# EAGLE design mainBoardV2 (EAGLE 6.6.0)

## Sheet 1 of 4
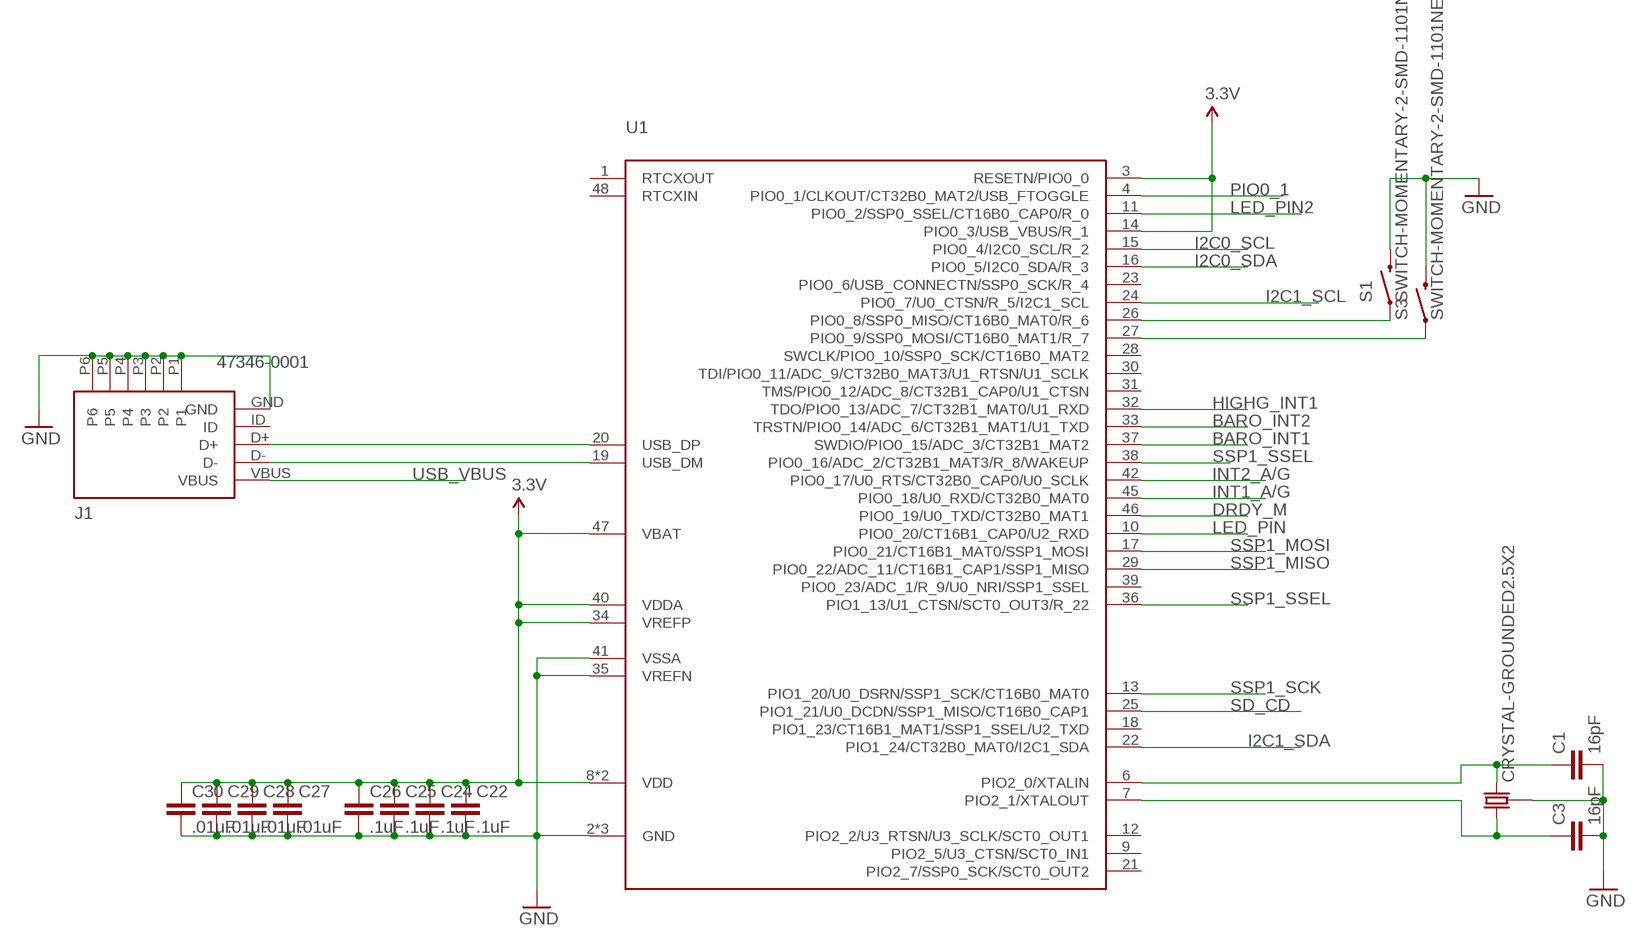
[diagram p0: schematic, sheet 1]

### Parts
C1  16pF  C0402  [C0402]
C3  16pF  C0402  [C0402]
C22  .1uF  C0402  [C0402]
C24  .1uF  C0402  [C0402]
C25  .1uF  C0402  [C0402]
C26  .1uF  C0402  [C0402]
C27  .01uF  C0402  [C0402]
C28  .01uF  C0402  [C0402]
C29  .01uF  C0402  [C0402]
C30  .01uF  C0402  [C0402]
J1  47346-0001  MICRO-USB  [MICRO_USB]
S1  SWITCH-MOMENTARY-2-SMD-1101NE  [TACTILE-SWITCH-1101NE]
S3  SWITCH-MOMENTARY-2-SMD-1101NE  [TACTILE-SWITCH-1101NE]
U1  LPC11U68JBD48  [LQFP48]
U$5  CRYSTAL-GROUNDED2.5X2  [CRYSTAL-SMD-2.5X2]

### Nets
3.3V: C22.1 C24.1 C25.1 C26.1 C27.1 C28.1 C29.1 C30.1 U1.3(RESETN/PIO0_0) U1.8(VDD) U1.14(PIO0_3/USB_VBUS/R_1) U1.34(VREFP) U1.40(VDDA) U1.44(VDD) U1.47(VBAT) ; also sheet 2,3,4
BARO_INT1: U1.37(SWDIO/PIO0_15/ADC_3/CT32B1_MAT2) ; also sheet 2
BARO_INT2: U1.33(TRSTN/PIO0_14/ADC_6/CT32B1_MAT1/U1_TXD) ; also sheet 2
DRDY_M: U1.46(PIO0_19/U0_TXD/CT32B0_MAT1) ; also sheet 2
GND: C1.2 C3.2 C22.2 C24.2 C25.2 C26.2 C27.2 C28.2 C29.2 C30.2 J1.GND J1.P1 J1.P2 J1.P3 J1.P4 J1.P5 J1.P6 S1.2 S3.2 U1.2(GND) U1.5(GND) U1.35(VREFN) U1.41(VSSA) U1.43(GND) U$5.GND1 U$5.GND2 ; also sheet 2,3,4
HIGHG_INT1: U1.32(TDO/PIO0_13/ADC_7/CT32B1_MAT0/U1_RXD) ; also sheet 2
HIGHG_INT2: U1.36(PIO1_13/U1_CTSN/SCT0_OUT3/R_22) ; also sheet 2
I2C0_SCL: U1.15(PIO0_4/I2C0_SCL/R_2) ; also sheet 2
I2C0_SDA: U1.16(PIO0_5/I2C0_SDA/R_3) ; also sheet 2
I2C1_SCL: U1.24(PIO0_7/U0_CTSN/R_5/I2C1_SCL) ; also sheet 2,3
I2C1_SDA: U1.22(PIO1_24/CT32B0_MAT0/I2C1_SDA) ; also sheet 2,3
INT1_A/G: U1.45(PIO0_18/U0_RXD/CT32B0_MAT0) ; also sheet 2
INT2_A/G: U1.42(PIO0_17/U0_RTS/CT32B0_CAP0/U0_SCLK) ; also sheet 2
LED_PIN: U1.10(PIO0_20/CT16B1_CAP0/U2_RXD) ; also sheet 3
LED_PIN2: U1.11(PIO0_2/SSP0_SSEL/CT16B0_CAP0/R_0) ; also sheet 3
N$2: C3.1 U1.7(PIO2_1/XTALOUT) U$5.P1
N$3: C1.1 U1.6(PIO2_0/XTALIN) U$5.P2
N$15: J1.D+ U1.20(USB_DP)
N$17: J1.D- U1.19(USB_DM)
N$18: S3.1 U1.27(PIO0_9/SSP0_MOSI/CT16B0_MAT1/R_7)
N$19: S1.1 U1.26(PIO0_8/SSP0_MISO/CT16B0_MAT0/R_6)
PIO0_1: U1.4(PIO0_1/CLKOUT/CT32B0_MAT2/USB_FTOGGLE) ; also sheet 4
SD_CD: U1.25(PIO1_21/U0_DCDN/SSP1_MISO/CT16B0_CAP1) ; also sheet 3
SSP1_MISO: U1.29(PIO0_22/ADC_11/CT16B1_CAP1/SSP1_MISO) ; also sheet 3
SSP1_MOSI: U1.17(PIO0_21/CT16B1_MAT0/SSP1_MOSI) ; also sheet 3
SSP1_SCK: U1.13(PIO1_20/U0_DSRN/SSP1_SCK/CT16B0_MAT0) ; also sheet 3
SSP1_SSEL: U1.38(PIO0_16/ADC_2/CT32B1_MAT3/R_8/WAKEUP) ; also sheet 3
USB_VBUS: J1.VBUS ; also sheet 4
Unconnected: J1.ID U1.1(RTCXOUT) U1.9(PIO2_5/U3_CTSN/SCT0_IN1) U1.12(PIO2_2/U3_RTSN/U3_SCLK/SCT0_OUT1) U1.18(PIO1_23/CT16B1_MAT1/SSP1_SSEL/U2_TXD) U1.21(PIO2_7/SSP0_SCK/SCT0_OUT2) U1.23(PIO0_6/USB_CONNECTN/SSP0_SCK/R_4) U1.28(SWCLK/PIO0_10/SSP0_SCK/CT16B0_MAT2) U1.30(TDI/PIO0_11/ADC_9/CT32B0_MAT3/U1_RTSN/U1_SCLK) U1.31(TMS/PIO0_12/ADC_8/CT32B1_CAP0/U1_CTSN) U1.39(PIO0_23/ADC_1/R_9/U0_NRI/SSP1_SSEL) U1.48(RTCXIN)

## Sheet 2 of 4
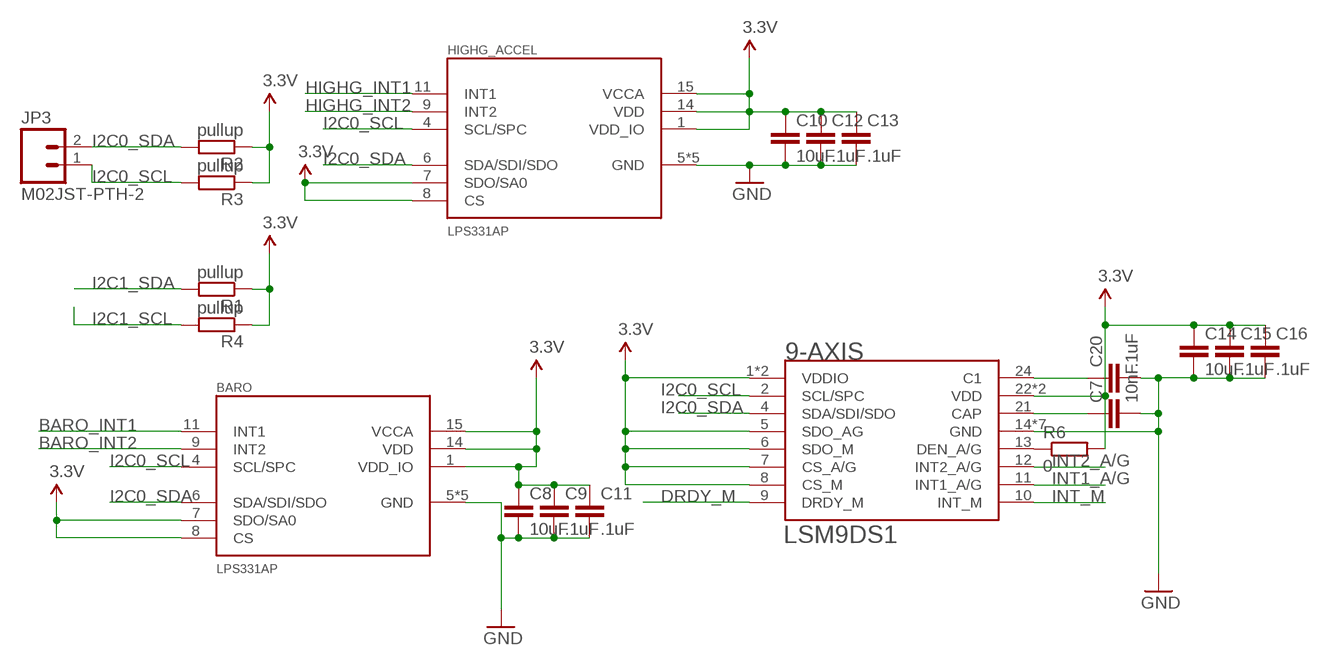
[diagram p1: schematic, sheet 2]

### Parts
9-AXIS  LSM9DS1  [LGA-24L-3.5X3X1]
BARO  LPS331AP  [LGA-16-3X3X1]
C7  10nF  C0402  [C0402]
C8  10uF  C0402  [C0402]
C9  .1uF  C0402  [C0402]
C10  10uF  C0402  [C0402]
C11  .1uF  C0402  [C0402]
C12  .1uF  C0402  [C0402]
C13  .1uF  C0402  [C0402]
C14  10uF  C0402  [C0402]
C15  .1uF  C0402  [C0402]
C16  .1uF  C0402  [C0402]
C20  .1uF  C0402  [C0402]
HIGHG_ACCEL  LPS331AP  [LGA-16-3X3X1]
JP3  M02JST-PTH-2  [JST-2-PTH]
R1  pullup  R0805  [R0805]
R2  pullup  R0402  [R0402]
R3  pullup  R0402  [R0402]
R4  pullup  R0805  [R0805]
R6  0  R0402  [R0402]

### Nets
3.3V: 9-AXIS.1(VDDIO) 9-AXIS.3(VDDIO) 9-AXIS.5(SDO_AG) 9-AXIS.6(SDO_M) 9-AXIS.7(CS_A/G) 9-AXIS.8(CS_M) 9-AXIS.22(VDD) 9-AXIS.23(VDD) BARO.1(VDD_IO) BARO.7(SDO/SA0) BARO.8(CS) BARO.14(VDD) BARO.15(VCCA) C8.1 C9.1 C10.1 C11.1 C12.1 C13.1 C14.1 C15.1 C16.1 HIGHG_ACCEL.1(VDD_IO) HIGHG_ACCEL.7(SDO/SA0) HIGHG_ACCEL.8(CS) HIGHG_ACCEL.14(VDD) HIGHG_ACCEL.15(VCCA) R1.1 R2.1 R3.1 R4.1 R6.2 ; also sheet 1,3,4
BARO_INT1: BARO.11(INT1) ; also sheet 1
BARO_INT2: BARO.9(INT2) ; also sheet 1
DRDY_M: 9-AXIS.9(DRDY_M) ; also sheet 1
GND: 9-AXIS.14(GND) 9-AXIS.15(GND) 9-AXIS.16(GND) 9-AXIS.17(GND) 9-AXIS.18(GND) 9-AXIS.19(GND) 9-AXIS.20(GND) BARO.5(GND) BARO.10(GND) BARO.12(GND) BARO.13(GND) BARO.16(GND) C7.2 C8.2 C9.2 C10.2 C11.2 C12.2 C13.2 C14.2 C15.2 C16.2 C20.2 HIGHG_ACCEL.5(GND) HIGHG_ACCEL.10(GND) HIGHG_ACCEL.12(GND) HIGHG_ACCEL.13(GND) HIGHG_ACCEL.16(GND) ; also sheet 1,3,4
HIGHG_INT1: HIGHG_ACCEL.11(INT1) ; also sheet 1
HIGHG_INT2: HIGHG_ACCEL.9(INT2) ; also sheet 1
I2C0_SCL: 9-AXIS.2(SCL/SPC) BARO.4(SCL/SPC) HIGHG_ACCEL.4(SCL/SPC) JP3.1 R3.2 ; also sheet 1
I2C0_SDA: 9-AXIS.4(SDA/SDI/SDO) BARO.6(SDA/SDI/SDO) HIGHG_ACCEL.6(SDA/SDI/SDO) JP3.2 R2.2 ; also sheet 1
I2C1_SCL: R4.2 ; also sheet 1,3
I2C1_SDA: R1.2 ; also sheet 1,3
INT1_A/G: 9-AXIS.11(INT1_A/G) ; also sheet 1
INT2_A/G: 9-AXIS.12(INT2_A/G) ; also sheet 1
INT_M: 9-AXIS.10(INT_M)
N$1: 9-AXIS.13(DEN_A/G) R6.1
N$11: 9-AXIS.21(CAP) C7.1
N$14: 9-AXIS.24(C1) C20.1

## Sheet 3 of 4
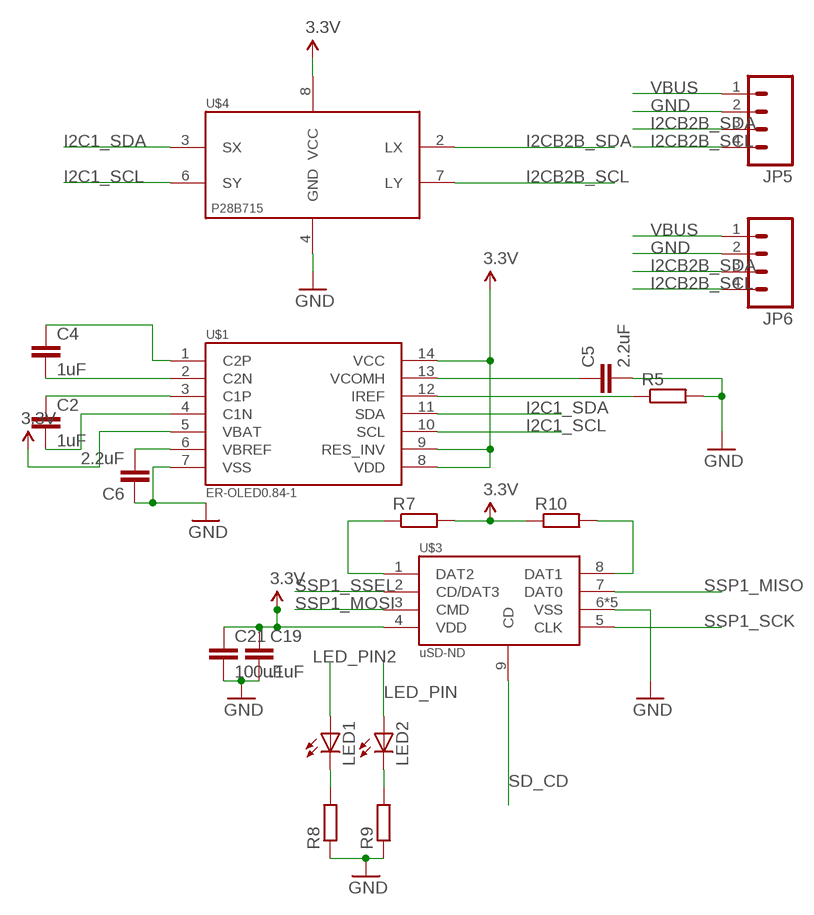
[diagram p2: schematic, sheet 3]

### Parts
C2  1uF  C0402  [C0402]
C4  1uF  C0402  [C0402]
C5  2.2uF  C0402  [C0402]
C6  2.2uF  C0402  [C0402]
C19  .1uF  C0402  [C0402]
C21  100uF  CC1206  [C1206]
JP5  M04JST  [1X04-1.5MM_JST]
JP6  M04JST  [1X04-1.5MM_JST]
LED1  LEDCHIPLED_0603  [CHIPLED_0603]
LED2  LEDCHIPLED_0603  [CHIPLED_0603]
R5  R0402  [R0402]
R7  R0402  [R0402]
R8  R0402  [R0402]
R9  R0402  [R0402]
R10  R0402  [R0402]
U$1  ER-OLED0.84-1  [MOLEX_52892-1433]
U$3  MICROSD-CD  [MOLEX_SD-47352-101]
U$4  P82B715  [SO8]

### Nets
3.3V: C19.1 C21.1 R7.2 R10.1 U$1.5(VBAT) U$1.8(VDD) U$1.9(RES_INV) U$1.14(VCC) U$3.4(VDD) U$4.8(VCC) ; also sheet 1,2,4
GND: C5.2 C6.1 C19.2 C21.2 JP5.2 JP6.2 R5.2 R8.1 R9.1 U$1.7(VSS) U$3.6(VSS) U$3.G1(VSS) U$3.G2(VSS) U$3.G3(VSS) U$3.G4(VSS) U$4.4(GND) ; also sheet 1,2,4
I2C1_SCL: U$1.10(SCL) U$4.6(SY) ; also sheet 1,2
I2C1_SDA: U$1.11(SDA) U$4.3(SX) ; also sheet 1,2
I2CB2B_SCL: JP5.4 JP6.4 U$4.7(LY)
I2CB2B_SDA: JP5.3 JP6.3 U$4.2(LX)
LED_PIN: LED2.A ; also sheet 1
LED_PIN2: LED1.A ; also sheet 1
N$4: LED1.C R8.2
N$5: LED2.C R9.2
N$6: C4.1 U$1.1(C2P)
N$7: C4.2 U$1.2(C2N)
N$8: C2.1 U$1.3(C1P)
N$9: C2.2 U$1.4(C1N)
N$10: C5.1 U$1.13(VCOMH)
N$12: R5.1 U$1.12(IREF)
N$13: C6.2 U$1.6(VBREF)
N$16: R7.1 U$3.1(DAT2)
N$21: R10.2 U$3.8(DAT1)
SD_CD: U$3.9(CD) ; also sheet 1
SSP1_MISO: U$3.7(DAT0) ; also sheet 1
SSP1_MOSI: U$3.3(CMD) ; also sheet 1
SSP1_SCK: U$3.5(CLK) ; also sheet 1
SSP1_SSEL: U$3.2(CD/DAT3) ; also sheet 1
VBUS: JP5.1 JP6.1 ; also sheet 4

## Sheet 4 of 4: Power
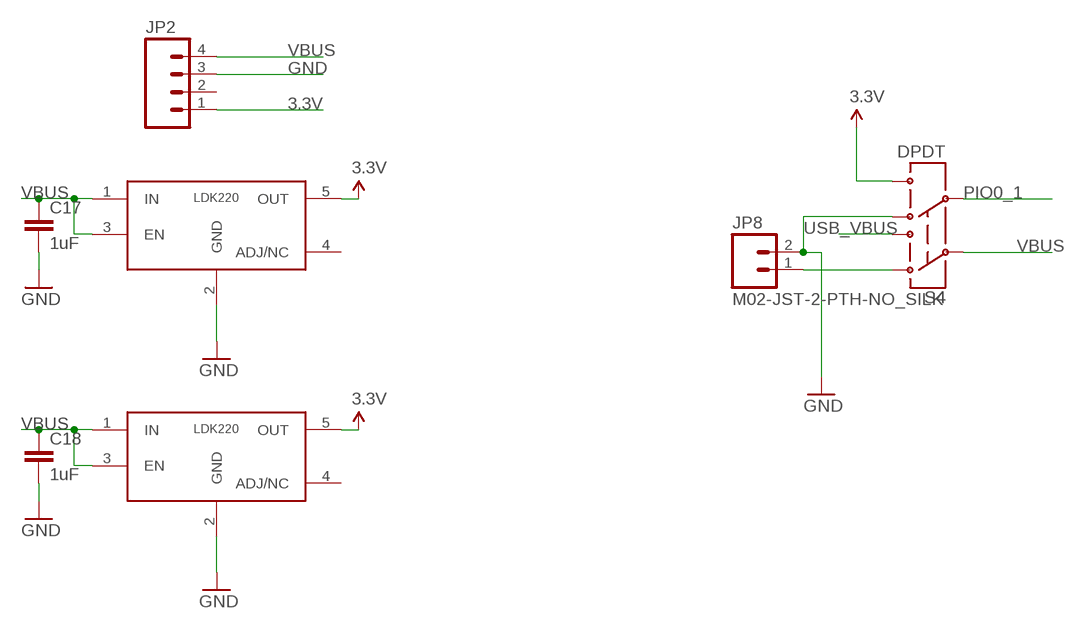
[diagram p3: schematic, sheet 4]

### Parts
C17  1uF  C0402  [C0402]
C18  1uF  C0402  [C0402]
JP2  M04JST  [1X04-1.5MM_JST]
JP8  M02-JST-2-PTH-NO_SILK  [JST-2-PTH-NS]
S4  DPDT  SWITCH-DPDTAYZ0202  [AYZ0202]
U$2  LDK220M33R  [SOT23-5]
U$6  LDK220M33R  [SOT23-5]

### Nets
3.3V: JP2.1 S4.6 U$2.5(OUT) U$6.5(OUT) ; also sheet 1,2,3
GND: C17.2 C18.2 JP2.3 JP8.2 S4.4 U$2.2(GND) U$6.2(GND) ; also sheet 1,2,3
N$20: JP8.1 S4.1
PIO0_1: S4.5 ; also sheet 1
USB_VBUS: S4.3 ; also sheet 1
VBUS: C17.1 C18.1 JP2.4 S4.2 U$2.1(IN) U$2.3(EN) U$6.1(IN) U$6.3(EN) ; also sheet 3
Unconnected: JP2.2 U$2.4(ADJ/NC) U$6.4(ADJ/NC)

## Library data of the parts
9-AXIS = Sensors:LSM9DS1; OC_NEWARK: unknown
BARO HIGHG_ACCEL = Sensors:LPS331AP; MPN: LPS331APTR; OC_NEWARK: 52X6707
C1 C3 = ELL-i-Passives:C: Surface Mount Capasitors — in standard sizes A capacitor used to store energy electrostatically in an electric field. If you need a high-value capacitor, consider using a polarised capacitor to save space. Wikipedia article on capacitors <https://en.wikipedia.org/wiki/Capacitor>; OC_NEWARK: unknown
C2 C4 = ELL-i-Passives:C: Surface Mount Capasitors — in standard sizes A capacitor used to store energy electrostatically in an electric field. If you need a high-value capacitor, consider using a polarised capacitor to save space. Wikipedia article on capacitors <https://en.wikipedia.org/wiki/Capacitor>; MPN: MC0402X105M6R3CT; OC_NEWARK: 06R4879
C5 C6 = ELL-i-Passives:C: Surface Mount Capasitors — in standard sizes A capacitor used to store energy electrostatically in an electric field. If you need a high-value capacitor, consider using a polarised capacitor to save space. Wikipedia article on capacitors <https://en.wikipedia.org/wiki/Capacitor>; MPN: C1005X6S0G225M050BC; OC_NEWARK: 91R0047
C7 C20 = ELL-i-Passives:C: Surface Mount Capasitors — in standard sizes A capacitor used to store energy electrostatically in an electric field. If you need a high-value capacitor, consider using a polarised capacitor to save space. Wikipedia article on capacitors <https://en.wikipedia.org/wiki/Capacitor>; MPN: S103M47Z5UN63L0R; OC_NEWARK: 83K9283
C8-C19 C21 C22 C24-C30 = ELL-i-Passives:C: Surface Mount Capasitors — in standard sizes A capacitor used to store energy electrostatically in an electric field. If you need a high-value capacitor, consider using a polarised capacitor to save space. Wikipedia article on capacitors <https://en.wikipedia.org/wiki/Capacitor>
J1 = ELL-i-Connectors:MICRO-USB: Micro USB from Molex CONN RCPT 5POS MICRO USB R/A Datasheet <http://www.molex.com/pdm_docs/sd/473460001_sd.pdf>; PARTNO: AS-ITM-00021
JP2 = SparkFun-Connectors:M04: Header 4 Standard 4-pin 0.1" header. Use with straight break away headers (SKU : PRT-00116), right angle break away headers (PRT-00553), swiss pins (PRT-00743), machine pins (PRT-00117), and female headers (PRT-00115). Molex polarized connector foot print use with SKU : PRT-08231 with associated crimp pins and housings. 1MM SMD Version SKU: PRT-10208
JP3 = SparkFun-Connectors:M02: Standard 2-pin 0.1" header. Use with - straight break away headers ( PRT-00116) - right angle break away headers (PRT-00553) - swiss pins (PRT-00743) - machine pins (PRT-00117) - female headers (PRT-00115) Molex polarized connector foot print use with: PRT-08233 with associated crimp pins and housings. 2.54_SCREWTERM for use with PRT-10571. 3.5mm Screw Terminal footprints for PRT-08084 5mm Screw Terminal footprints for use with PRT-08432; OC_NEWARK: unknown; SKU: PRT-09914
JP5 JP6 = SparkFun-Connectors:M04: Header 4 Standard 4-pin 0.1" header. Use with straight break away headers (SKU : PRT-00116), right angle break away headers (PRT-00553), swiss pins (PRT-00743), machine pins (PRT-00117), and female headers (PRT-00115). Molex polarized connector foot print use with SKU : PRT-08231 with associated crimp pins and housings. 1MM SMD Version SKU: PRT-10208; OC_NEWARK: unknown
JP8 = SparkFun-Connectors:M02: Standard 2-pin 0.1" header. Use with - straight break away headers ( PRT-00116) - right angle break away headers (PRT-00553) - swiss pins (PRT-00743) - machine pins (PRT-00117) - female headers (PRT-00115) Molex polarized connector foot print use with: PRT-08233 with associated crimp pins and housings. 2.54_SCREWTERM for use with PRT-10571. 3.5mm Screw Terminal footprints for PRT-08084 5mm Screw Terminal footprints for use with PRT-08432; OC_NEWARK: unknown
LED1 LED2 = adafruit:LED: LED OSRAM: - CHIPLED LG R971, LG N971, LY N971, LG Q971, LY Q971, LO R971, LY R971 LH N974, LH R974 LS Q976, LO Q976, LY Q976 LO Q996 - Hyper CHIPLED LW Q18S LB Q993, LB Q99A, LB R99A - SideLED LS A670, LO A670, LY A670, LG A670, LP A670 LB A673, LV A673, LT A673, LW A673 LH A674 LY A675 LS A676, LA A676, LO A676, LY A676, LW A676 LS A679, LY A679, LG A679 - Hyper Micro SIDELED® LS Y876, LA Y876, LO Y876, LY Y876 LT Y87S - SmartLED LW L88C, LW L88S LB L89C, LB L89S, LG L890 LS L89K, LO L89K, LY L89K LS L896, LA L896, LO L896, LY L896 - TOPLED LS T670, LO T670, LY T670, LG T670, LP T670 LSG T670, LSP T670, LSY T670, LOP T670, LYG T670 LG T671, LOG T671, LSG T671 LB T673, LV T673, LT T673, LW T673 LH T674 LS T676, LA T676, LO T676, LY T676, LB T676, LH T676, LSB T676, LW T676 LB T67C, LV T67C, LT T67C, LS T67K, LO T67K, LY T67K, LW E67C LS E67B, LA E67B, LO E67B, LY E67B, LB E67C, LV E67C, LT E67C LW T67C LS T679, LY T679, LG T679 LS T770, LO T770, LY T770, LG T770, LP T770 LB T773, LV T773, LT T773, LW T773 LH T774 LS E675, LA E675, LY E675, LS T675 LS T776, LA T776, LO T776, LY T776, LB T776 LHGB T686 LT T68C, LB T68C - Hyper Mini TOPLED® LB M676 - Mini TOPLED Santana® LG M470 LS M47K, LO M47K, LY M47K Source: http://www.osram.convergy.de/; OC_NEWARK: unknown
R1-R5 R8 R9 = ELL-i-Passives:R: Surface Mount Resistor — in standard sizes; OC_NEWARK: unknown
R6 R7 R10 = ELL-i-Passives:R: Surface Mount Resistor — in standard sizes
S1 S3 = SparkFun-Electromechanical:SWITCH-MOMENTARY-2: Various NO switches- pushbuttons, reed, etc; OC_NEWARK: unknown
S4 = SparkFun-Electromechanical:SWITCH-DPDT: DPDT Version of the COM-00597; OC_NEWARK: unknown; PROD_ID: SWCH-08179
U1 = LPC11U68:LPC11U68JBD48; OC_NEWARK: unknown
U$1 = Sensors:ER-OLED0.84-1; OC_NEWARK: unknown
U$2 U$6 = Sensors:LDK220M33R; OC_NEWARK: unknown
U$3 = Sensors:MICROSD-CD; OC_NEWARK: unknown
U$4 = Sensors:P82B715; OC_NEWARK: unknown
U$5 = SparkFun-FreqCtrl:CRYSTAL-GROUNDED; OC_NEWARK: unknown

## Board
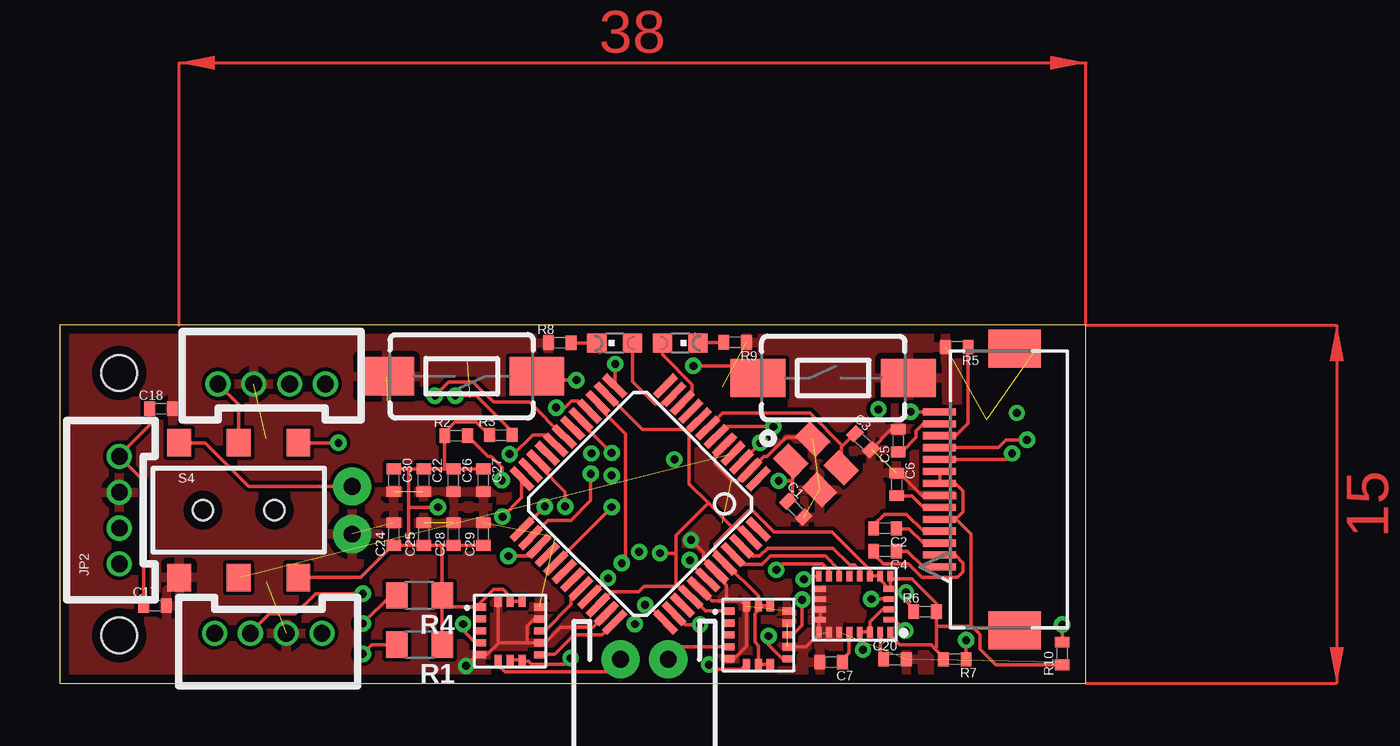
[diagram p4: board, top side]
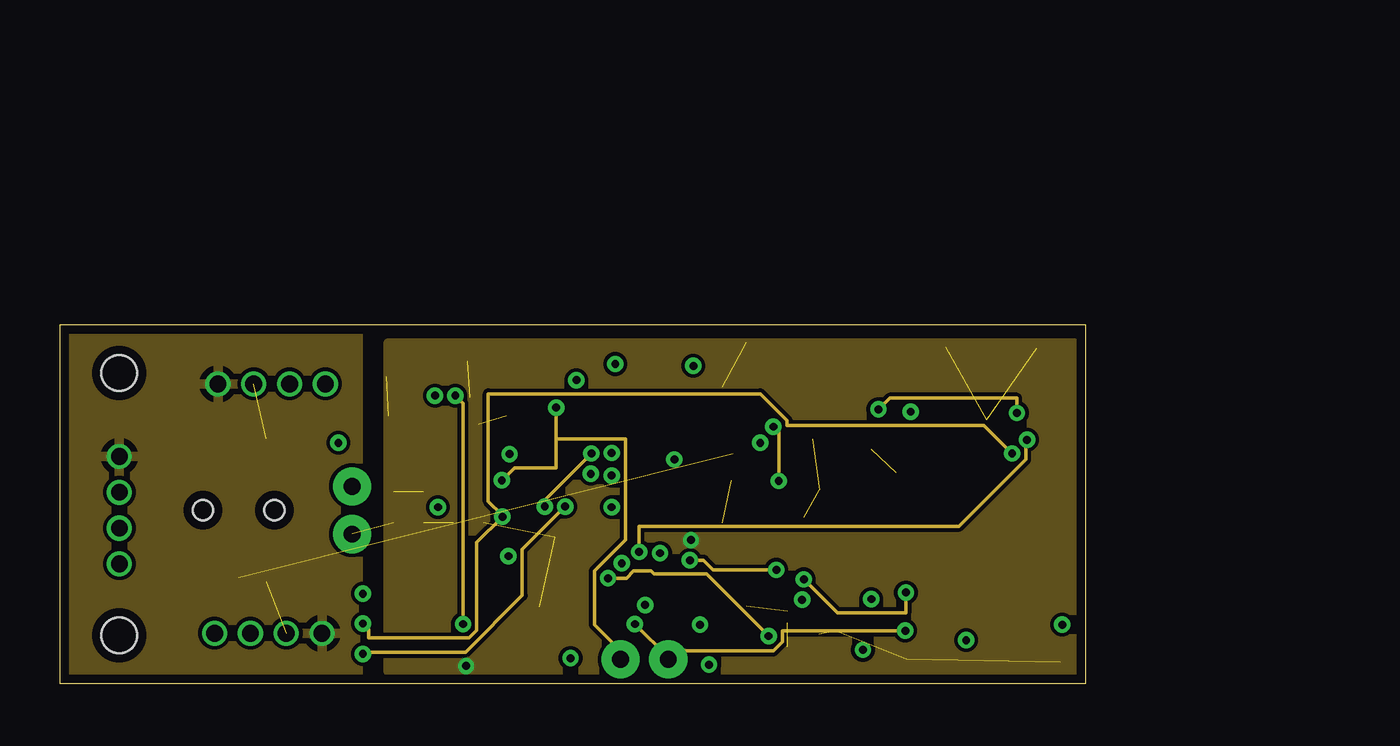
[diagram p5: board, inner layer Route2]
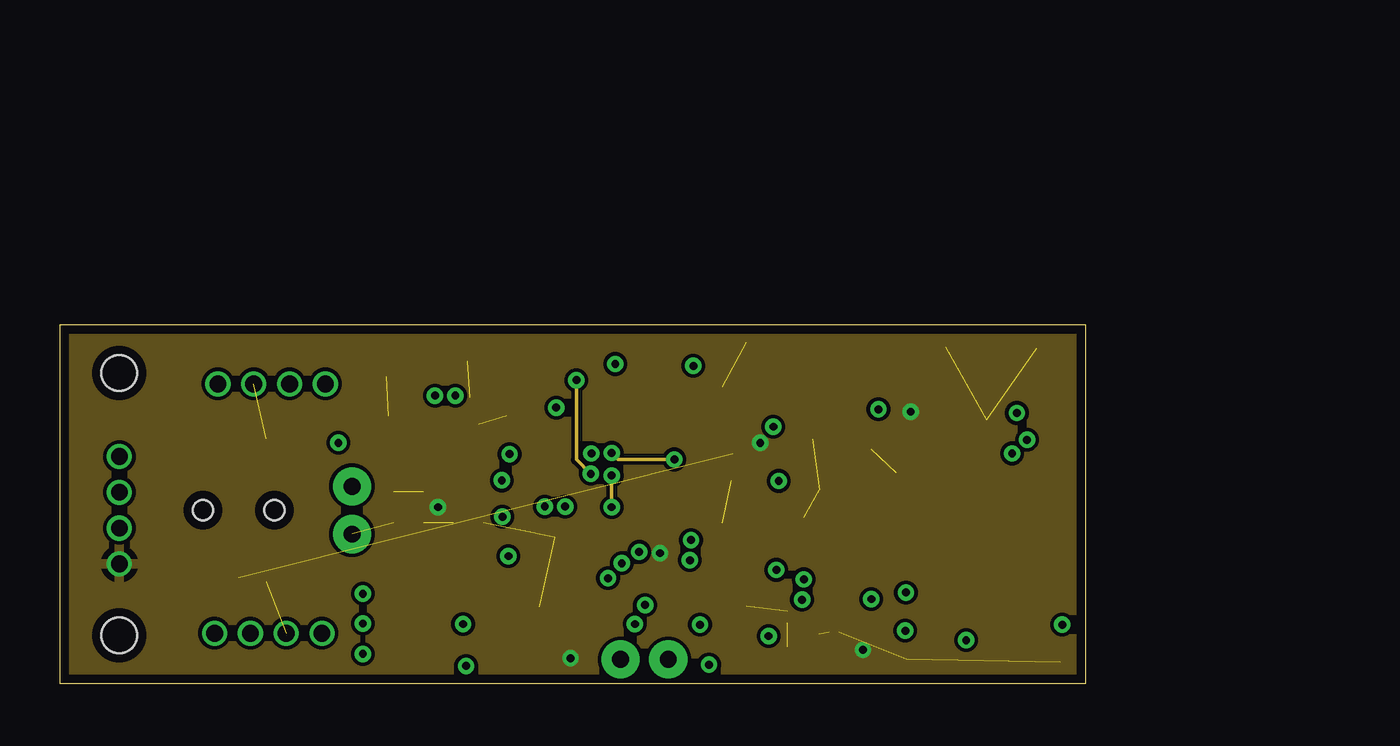
[diagram p6: board, inner layer Route15]
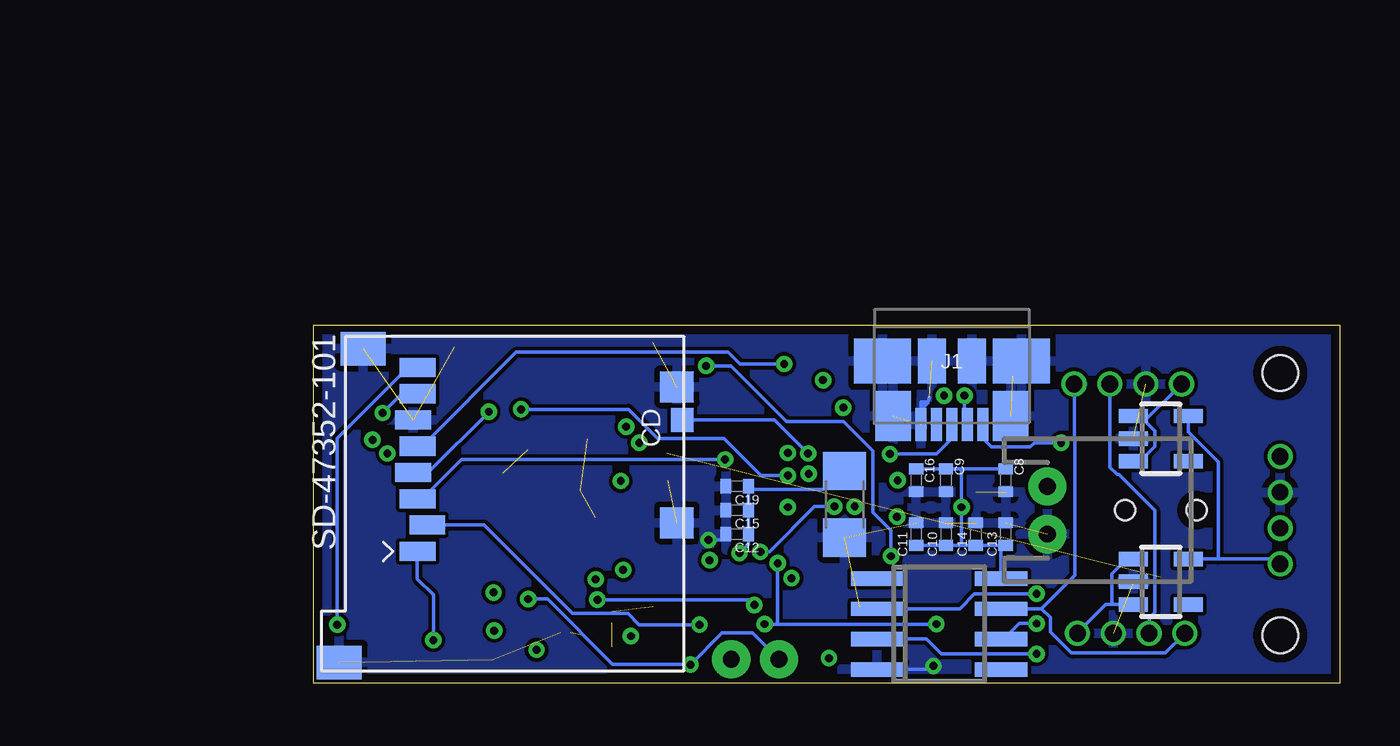
[diagram p7: board, bottom side, seen from below]

Size 43 x 15 mm. Coordinates in mm from the lower left corner, seen from the top.
Outline: 0,0 43,0 43,15 0,15 0,0
Copper layers (1*2*15*16): Top 0.0356mm / dielectric 1.5011mm / Route2 0.0356mm / dielectric 0.1499mm / Route15 0.0356mm / dielectric 0.2007mm / Bottom 0.0356mm
Design rules "LaenPCBOrder *": minimum track width 6mil, minimum drill 13mil, track to track 6mil, track to pad 6mil, pad to pad 6mil, via to via 6mil, smd to smd 6mil, copper to edge 15mil, drill to drill 6mil, minimum pad ring 7mil, minimum via ring 7mil, stop-mask expansion 3mil, vias tented up to drill 0mil, thermal gap 10mil
Holes 1.5 mm at 2.5,2 2.5,13

### Footprints (pad centres in the part's own frame; a part is rotated, then mirrored left to right if it is on the bottom)
LGA-24L-3.5X3X1 = smd 0.24 x 0.45: 1 0.245,2.675; 6 0.245,0.325; 7 0.675,0.325; 8 1.105,0.325; 9 1.535,0.325; 10 1.965,0.325; 11 2.395,0.325; 12 2.825,0.325; 13 3.255,0.325; 18 3.255,2.675; 19 2.825,2.675; 20 2.395,2.675; 21 1.965,2.675; 22 1.535,2.675; 23 1.105,2.675; 24 0.675,2.675 | smd 0.45 x 0.24: 2 0.325,2.145; 3 0.325,1.715; 4 0.325,1.285; 5 0.325,0.855; 14 3.175,0.855; 15 3.175,1.285; 16 3.175,1.715; 17 3.175,2.145
LGA-16-3X3X1 = smd 0.45 x 0.3: 1 0.275,2.5; 2 0.275,2; 3 0.275,1.5; 4 0.275,1; 5 0.275,0.5; 9 2.725,0.5; 10 2.725,1; 11 2.725,1.5; 12 2.725,2; 13 2.725,2.5 | smd 0.3 x 0.45: 6 1,0.275; 7 1.5,0.275; 8 2,0.275; 14 2,2.725; 15 1.5,2.725; 16 1,2.725
C0402 = smd 0.45 x 0.6: 1 -0.475,0; 2 0.475,0
C1206 = smd 1.6 x 1.8: 1 -1.4,0; 2 1.4,0
MICRO_USB = smd 1.38 x 0.45: D+ 2.66,0; D- 2.66,0.65; GND 2.66,-1.3; ID 2.66,-0.65; VBUS 2.66,1.3 | smd 2.1 x 1.475: P1 2.3,-2.462; P2 2.3,2.462 | smd 1.9 x 2.375: P3 0,2.913; P4 0,-2.913 | smd 1.9 x 1.175: P5 0,0.838; P6 0,-0.838
1X04-1.5MM_JST = drill 0.7: 1 0,0; 2 1.5,0; 3 3,0; 4 4.5,0
JST-2-PTH = drill 0.7 pad 1.6: 1 -1,0; 2 1,0
JST-2-PTH-NS = drill 0.7 pad 1.6: 1 -1,0; 2 1,0
CHIPLED_0603 = smd 0.8 x 0.8: A 0,-0.75; C 0,0.75
R0805 = smd 0.9 x 1.1: 1 -0.95,0; 2 0.95,0
R0402 = smd 0.45 x 0.6: 1 -0.475,0; 2 0.475,0
TACTILE-SWITCH-1101NE = smd 2.3 x 1.6: 1 -3.15,0; 2 3.15,0
AYZ0202 = smd 1 x 1.15: 1 -2.5,2.825; 2 0,2.825; 3 2.5,2.825; 4 -2.5,-2.825; 5 0,-2.825; 6 2.5,-2.825 | hole 0.85: 1.5,0; -1.5,0
LQFP48 = smd 0.3 x 1.2: 1 -2.75,-4.25; 2 -2.25,-4.25; 3 -1.75,-4.25; 4 -1.25,-4.25; 5 -0.75,-4.25; 6 -0.25,-4.25; 7 0.25,-4.25; 8 0.75,-4.25; 9 1.25,-4.25; 10 1.75,-4.25; 11 2.25,-4.25; 12 2.75,-4.25; 25 2.75,4.25; 26 2.25,4.25; 27 1.75,4.25; 28 1.25,4.25; 29 0.75,4.25; 30 0.25,4.25; 31 -0.25,4.25; 32 -0.75,4.25; 33 -1.25,4.25; 34 -1.75,4.25; 35 -2.25,4.25; 36 -2.75,4.25 | smd 1.2 x 0.3: 13 4.25,-2.75; 14 4.25,-2.25; 15 4.25,-1.75; 16 4.25,-1.25; 17 4.25,-0.75; 18 4.25,-0.25; 19 4.25,0.25; 20 4.25,0.75; 21 4.25,1.25; 22 4.25,1.75; 23 4.25,2.25; 24 4.25,2.75; 37 -4.25,2.75; 38 -4.25,2.25; 39 -4.25,1.75; 40 -4.25,1.25; 41 -4.25,0.75; 42 -4.25,0.25; 43 -4.25,-0.25; 44 -4.25,-0.75; 45 -4.25,-1.25; 46 -4.25,-1.75; 47 -4.25,-2.25; 48 -4.25,-2.75
MOLEX_52892-1433 = smd 0.3 x 1.4: 1 3.25,2.896; 2 2.75,2.896; 3 2.25,2.896; 4 1.75,2.896; 5 1.25,2.896; 6 0.75,2.896; 7 0.25,2.896; 8 -0.25,2.896; 9 -0.75,2.896; 10 -1.25,2.896; 11 -1.75,2.896; 12 -2.25,2.896; 13 -2.75,2.896; 14 -3.25,2.896 | smd 1.6 x 2.2: LFIT -5.9,6.046; RFIT 5.9,6.046
SOT23-5 = smd 0.6 x 1.2: 1 -0.95,-1.15; 2 0,-1.15; 3 0.95,-1.15; 4 0.95,1.15; 5 -0.95,1.15
MOLEX_SD-47352-101 = smd 0.8 x 1.5: 1 9.19,3.24; 2 8.09,3.64; 3 6.99,3.24; 4 5.89,3.04; 5 4.79,3.24; 6 3.69,3.04; 7 2.59,3.24; 8 1.49,3.24 | smd 1 x 0.95: 9 3.69,14.325 | smd 1.4 x 1.9: G1 13.85,-0.05; G4 0.7,0.95 | smd 1.3 x 1.4: G2 8,14.1; G3 2.3,14.1
SO8 = smd 0.6 x 2.2: 1 -1.905,-2.6; 2 -0.635,-2.6; 3 0.635,-2.6; 4 1.905,-2.6; 5 1.905,2.6; 6 0.635,2.6; 7 -0.635,2.6; 8 -1.905,2.6
CRYSTAL-SMD-2.5X2 = smd 1.2 x 0.9: GND1 0.6,1.8; GND2 2.3,0.5; P1 2.3,1.8; P2 0.6,0.5

### Placement (x,y rotation side)
9-AXIS  35.05,4.81 180 top
BARO  27.77,0.52 0 top
C1  30.84,7.29 315 top
C2  34.58,6.49 180 top
C3  33.65,10.12 315 top
C4  34.58,5.53 180 top
C5  35.13,10.17 90 top
C6  35.06,8.33 270 top
C7  32.32,0.88 180 top
C8  14,8.5 270 bottom
C9  16.5,8.5 270 bottom
C10  16.5,6.25 90 bottom
C11  17.75,6.25 90 bottom
C12  25.25,6.25 180 bottom
C13  14,6.25 90 bottom
C14  15.25,6.25 90 bottom
C15  25.25,7.25 180 bottom
C16  17.75,8.5 270 bottom
C17  4,3.25 0 top
C18  4.25,11.5 0 top
C19  25.25,8.25 180 bottom
C20  35,1 0 top
C21  20.75,7.5 270 bottom
C22  15.25,8.5 270 top
C24  14,6.25 90 top
C25  15.25,6.25 90 top
C26  16.5,8.5 270 top
C27  17.75,8.5 270 top
C28  16.5,6.25 90 top
C29  17.75,6.25 90 top
C30  14,8.5 270 top
HIGHG_ACCEL  17.37,0.69 0 top
J1  16.25,13.5 270 bottom
JP2  2.5,5 90 top
JP3  24.5,1 180 top
JP5  6.63,12.54 0 top
JP6  10.99,2.09 180 top
JP8  12.25,7.25 270 bottom
LED1  23.25,14.25 90 top
LED2  26,14.25 270 top
R1  15.08,1.62 180 top
R2  16.61,10.37 0 top
R3  18.48,10.4 0 top
R4  15.08,3.68 180 top
R5  37.58,14.09 180 top
R6  36.25,3 0 top
R7  37.5,1 180 top
R8  20.95,14.26 0 top
R9  28.3,14.28 180 top
R10  42,1.25 90 top
S1  16.84,12.86 180 top
S3  32.41,12.79 0 top
S4  7.5,7.25 0 top
U1  24.32,7.51 135 top
U$1  33.96,8.12 270 top
U$2  7.5,10.25 270 bottom
U$3  41.87,14.72 270 bottom
U$4  16.79,2.48 270 bottom
U$5  29.85,9.38 315 top
U$6  7.5,4.25 270 bottom

### Tracks (layer width: path | path; a pad name or v marks a point on that pad's centre or on a via)
3.3V  (via drill 0.33)
  Top 0.152: 37.55,6.88 36.88,6.88 U$1.5 | 37.55,6.88 37.85,7.17 37.85,8.05 37.52,8.38 36.88,8.38 U$1.8 36.88,8.45 36.88,8.85 U$1.9 | 36.67,1.45 37.02,1.1 R7.2 | 36.67,1.45 36.52,1.6 35.2,1.6 34.8,2 9-AXIS.1 | 36.73,2.38 36.73,1.5 36.67,1.45 | 36.73,2.38 R6.2 36.73,3.35 35.7,4.38 34.88,4.38 9-AXIS.6 34.8,4 9-AXIS.5 34.73,3.98 34.38,4.33 9-AXIS.7 34.3,4.5 33.95,4.5 9-AXIS.8 33.95,4.58 33.95,4.75 32.35,6.35 29.93,6.35 29.05,7.22 28.85,7.22 28.23,6.6 28.23,6.53 | R10.1 39.23,0.78 38.55,1.45 38.55,2.05 38.23,2.38 38.17,2.38 | 36.73,2.38 38.17,2.38 | 37.55,6.88 38.17,6.25 38.17,2.38 | BARO.1 28.02,3.02 27.05,3.02 U1.40 26.38,3.65 25.98,4.05 25.82,4.05 | 25.82,4.05 24.48,4.05 24.25,3.83 23.12,3.83 22.57,3.27 U1.34 | 26.38,10.62 24.43,10.62 22.95,12.1 22.93,12.1 U1.14 | 26.38,10.62 26.77,11.03 U1.8 | BARO.8 29.75,0.8 BARO.7 29.27,0.88 29.27,1.57 29.12,1.73 29.12,2.9 29.27,3.05 29.27,3.17 BARO.15 | BARO.15 29.75,3.25 BARO.14 | BARO.15 29.27,3.33 29.27,3.65 27.9,5.03 27.88,5.03 U1.44 27.8,5.08 27.45,5.42 27.45,5.83 28.15,6.53 | 28.15,6.53 28.23,6.53 | 28.23,6.53 28.45,6.53 28.88,6.1 28.9,6.1 U1.47 | 26.38,10.62 26.38,8.35 27.18,7.55 | 27.18,7.55 28.12,6.6 28.15,6.53 | 25.82,5.45 25.82,6.2 27.18,7.55 | 25.82,5.45 25.82,4.05 | HIGHG_ACCEL.14 19.35,3.42 HIGHG_ACCEL.15 18.88,3.5 18.88,3.62 18.57,3.92 18.18,3.92 17.52,3.27 HIGHG_ACCEL.1 17.62,3.2 16.43,3.2 16.02,3.6 R4.1 | R1.1 16.02,3.5 R4.1 | 14.62,8.97 C22.1 16.12,8.97 | 14.62,8.97 C30.1 | 16.12,8.97 C26.1 C27.1 | 16.12,8.97 16.12,10.35 R2.1 16.12,10.43 16.12,10.5 16.57,10.95 17.45,10.95 R3.1 | 14.62,5.78 C25.1 16.02,5.78 | 14.62,5.78 C24.1 13.93,5.75 12.6,4.42 S4.6
  Top 0.152: 16.02,5.78 C28.1 C29.1 | 14.62,5.78 14.62,7.38 | 14.62,7.38 14.62,8.97 | 16.02,5.78 16.02,3.75 R4.1 | 9-AXIS.3 34.48,3.1 33.95,2.58 33.95,2.23 9-AXIS.23 33.92,2.15 33.52,2.15 9-AXIS.22 33.52,2.08 33.52,1.52 v33.65,1.4 | HIGHG_ACCEL.7 18.88,0.97 19.35,0.97 HIGHG_ACCEL.8 19.43,0.93 19.65,0.93 19.77,0.8 21.15,0.8 v21.4,1.05 | v29.35,10.07 28.57,9.3 U1.3 | v35.65,11.38 U$1.14 | v15.85,7.38 14.62,7.38 | v25.15,5.45 25.82,5.45
  Bottom 0.152: 15.85,8.97 C26.1 C27.1 | 15.85,8.97 C30.1 | 15.85,5.78 C25.1 C24.1 14.2,5.7 14.2,4.4 U$4.8 | 15.85,5.78 C28.1 C29.1 | 15.85,5.78 v15.85,7.38 15.85,8.97 | C21.1 20.88,8.9 21.65,8.12 24.7,8.12 C19.1 C15.1 C12.1 24.77,5.83 v25.15,5.45 | 5.1,5.2 2.7,5.2 JP2.1 | 5.1,5.2 U$6.5 | U$2.5 6.35,10.53 5.1,9.28 5.1,5.2 | v35.65,11.38 38.2,8.82 U$3.4
  pour Route15: 0.5,14.5 42.5,14.5 42.5,0.25 0.5,0.25
BARO_INT1  (via drill 0.33)
  Top 0.152: v31.1,3.5 31.1,2.42 30.7,2.02 BARO.11 | v24.52,3.27 24.65,3.27 U1.37
  Bottom 0.152: v31.1,3.5 24.75,3.5 v24.52,3.27
BARO_INT2  (via drill 0.33)
  Top 0.152: v29.7,1.98 29.7,1.6 30.27,1.02 30.48,1.02 BARO.9 | v22.98,4.4 U1.33
  Route2 0.152: v29.7,1.98 27.1,4.58 24.9,4.58 24.77,4.7 24.05,4.7 23.75,4.4 v22.98,4.4
DRDY_M
  Top 0.152: 9-AXIS.9 33.52,4.5 33.52,4.72 33.3,4.95 33.1,4.95 32.4,5.65 29.65,5.65 29.32,5.33 29,5.33 28.57,5.75 U1.46
GND  (via drill 0.33)  (25 unrouted)
  Top 0.152: 18.4,1.7 17.9,1.2 HIGHG_ACCEL.5 17.57,1.2 17.5,1.2 v17.02,0.72 | 19.57,1.7 20.07,1.7 HIGHG_ACCEL.10 20.15,1.7 20.32,1.7 20.98,2.35 22.35,2.35 U1.35 | 19.57,1.7 18.4,1.7 | HIGHG_ACCEL.16 18.38,3.4 18.38,1.77 18.4,1.7 | BARO.5 28.25,1.02 28.77,1.55 28.77,3.23 BARO.16 28.7,3.27 28.52,3.45 27.93,3.45 | 27.93,3.45 27.32,3.45 26.82,3.95 26.8,3.95 U1.41 | 27.93,3.45 27.93,4.1 27.52,4.5 27.52,4.67 U1.43 27.45,4.72 26.98,5.2 26.98,5.47 v26.45,6 | U1.5 27.45,9.57 27.45,9.2 28.15,8.5 28.5,8.5 28.9,8.9 U1.2 28.98,8.97 29.5,9.5 29.62,9.5 30.43,10.3 31.45,10.3 31.52,10.22 U$5.GND1 | BARO.10 31.27,1.52 31.8,2.05 9-AXIS.18 31.8,2.2 31.8,2.65 9-AXIS.17 9-AXIS.16 | C3.2 34,9.8 34.85,10.65 C5.2 | U$1.7 36.12,7.88 35.2,8.8 35.08,8.8 C6.1 | 19.57,1.7 19.57,2.38 19.9,2.7 20.07,2.7 HIGHG_ACCEL.12 | C22.2
  Bottom 0.152: U$4.4 17.18,0.57 v17.02,0.72 | J1.GND 17.55,11.78 17.27,11.78 17.25,11.75 17.43,11.57 17.52,11.57 17.52,11.75 17.27,11.75 17.25,11.78 17.2,11.97 | v26.45,6 25.88,6 25.73,6.15 C12.2
  pour Bottom: 0.25,0 43,0 43,15 0.25,15
  pour Top: 0.25,15 43,15 43,0 0.25,0
  pour Route2: 13.75,14.25 42.5,14.25 42.5,0.5 13.75,0.5 13.75,14
HIGHG_INT1
  Top 0.152: HIGHG_ACCEL.11 20.32,2.2 21.43,3.3 21.43,3.55 21.82,3.95 U1.32
HIGHG_INT2
  Top 0.152: HIGHG_ACCEL.9 20.73,1.2 21.55,2.02 22.73,2.02 U1.36
I2C0_SCL  (via drill 0.33)
  Top 0.152: JP3.1 26.02,1.52 28.02,1.52 BARO.4 | v16.9,2.48 16.9,2.23 17.43,1.7 17.62,1.7 HIGHG_ACCEL.4 | v35.42,2.2 34.95,2.67 34.73,2.67 9-AXIS.2 | v16.57,12.05 17.45,12.05 18.95,10.55 R3.2 | v23.55,5.03 23.7,5.17 23.7,10.45 22.57,11.57 22.57,11.75 U1.15
  Route2 0.152: v24.1,2.48 25.5,1.07 JP3.1 25.5,1.35 29.9,1.35 30.27,1.73 30.27,2.2 v35.42,2.2 | v16.57,12.05 16.9,11.72 v16.9,2.48
  Bottom 0.152: v24.1,2.48 23.55,2.48 | 23.55,2.48 v16.9,2.48 | 23.55,2.48 v23.55,5.03
I2C0_SDA  (via drill 0.33)
  Top 0.152: v18.52,8.5 18.52,9.05 18.07,9.5 17.95,9.5 17.1,10.35 R2.2 | v20.8,11.55 21.18,11.55 21.45,11.82 21.73,11.82 22.18,11.38 U1.16 | JP3.2 22.98,0.47 18.65,0.47 18.38,0.75 HIGHG_ACCEL.6 | BARO.6 28.55,0.57 27.4,0.57 v27.2,0.78 | v34,3.52 9-AXIS.4
  Route2 0.152: v18.52,8.5 19.05,9.03 20.8,9.03 20.8,10.22 | v20.8,11.55 20.8,10.22 | 20.8,10.22 23.7,10.22 23.7,6 22.4,4.7 22.4,2.45 23.5,1.35 JP3.2
  Bottom 0.152: JP3.2 24.6,2.1 25.88,2.1 v27.2,0.78 27.27,0.8 30.48,0.8 33.2,3.52 v34,3.52
I2C1_SCL  (via drill 0.33)
  Top 0.152: v12.7,2.5 13.88,3.67 R4.2 | v18.55,6.97 19.35,7.78 19.35,8.55 U1.24 | v39.9,9.62 39.65,9.38 36.88,9.38 U$1.10
  Route2 0.152: v12.7,2.5 12.95,2.25 12.95,1.9 17.15,1.9 17.48,2.23 17.48,5.9 v18.55,6.97 18.52,7.05 17.95,7.62 17.95,12.12 29.35,12.12 30.48,11 30.48,10.8 38.73,10.8 v39.9,9.62
  Bottom 0.152: v12.7,2.5 13.43,2.5 14.07,1.85 14.18,1.85 U$4.6
I2C1_SDA  (via drill 0.33)
  Top 0.152: v12.7,1.23 13.07,1.6 14.12,1.6 R1.2 | v21.18,7.4 21.18,8.03 20.1,9.1 20.1,9.28 U1.22 | v40.52,10.2 39.65,10.2 39.33,9.88 36.88,9.88 U$1.11
  Route2 0.152: v21.18,7.4 19.38,5.6 19.38,3.67 17,1.3 12.7,1.3 v12.7,1.23 | v40.52,10.2 40.48,10.15 40.48,9.38 37.67,6.58 24.27,6.58 v24.27,5.5
  Bottom 0.152: v12.7,1.23 16.7,1.23 17.32,1.85 19.38,1.85 U$4.3 | v24.27,5.5 23.9,5.5 22,7.4 v21.18,7.4
I2CB2B_SCL
  Bottom 0.152: 12.5,3.12 12.12,2.75 12.12,2.15 11.25,1.27 7.3,1.27 6.5,2.08 JP6.4 | 12.5,3.12 14.18,3.12 U$4.7 | 12.5,3.12 11.1,4.53 11.1,10.32 11.12,10.35 11.12,12.53 JP5.4
I2CB2B_SDA  (via drill 0.33)
  Top 0.152: v12.7,3.75 10.72,3.75 9.88,2.9 8.78,2.9 7.97,2.1 JP6.3
  Bottom 0.152: JP6.3 7.97,2.1 7.97,2.75 7.75,2.98 7.75,7.25 9.25,8.75 9.32,8.75 9.62,9.05 9.62,12.53 JP5.3 | v12.7,3.75 15.3,3.75 15.93,3.12 19.38,3.12 U$4.2
INT1_A/G
  Top 0.152: 9-AXIS.11 32.65,4.5 32.65,4.75 32.08,5.33 29.77,5.33 29.43,4.97 28.65,4.97 28.23,5.4 U1.45
INT2_A/G  (via drill 0.33)
  Top 0.152: 9-AXIS.12 32.23,4.72 31.95,5 30.27,5 v30.02,4.75 | v26.4,5.15 26.4,5.05 27.12,4.33 U1.42
  Route2 0.152: v30.02,4.75 27.38,4.75 26.98,5.15 v26.4,5.15
LED_PIN
  Top 0.152: LED2.A 25.25,13.78 26.5,12.53 26.5,12.18 26.1,11.78 U1.10
LED_PIN2
  Top 0.152: LED1.A 24,12.65 24.95,11.7 25.32,11.7 U1.11
N$1  (via drill 0.33)
  Top 0.152: v31.18,4.35 31.3,4.47 31.77,4.47 9-AXIS.13 | v35.45,3.8 35.45,3.45 35.77,3.12 R6.1
  Route2 0.152: v31.18,4.35 32.58,2.95 35.45,2.95 v35.45,3.8
N$2
  Top 0.152: 32.8,9.95 32.75,9.9 32.75,9.05 U$5.P1 | 32.8,9.95 C3.1 | 32.8,9.95 31.43,11.32 27.77,11.32 U1.7
N$3  (via drill 0.33)
  Top 0.152: 30.7,8.47 30.7,9.28 30.65,9.32 U$5.P2 | 30.7,8.47 30.7,7.83 30.52,7.65 C1.1 | v29.9,10.75 27.93,10.75 27.52,10.35 U1.6 | 30.7,8.47 v30.12,8.47
  Route2 0.152: v29.9,10.75 30.12,10.53 v30.12,8.47
N$4
  Top 0.152: LED1.C R8.2
N$5
  Top 0.152: LED2.C 26.77,14.25 26.8,14.28 R9.2
N$6
  Top 0.152: C4.1 35.08,5.53 35.52,5.53 36.17,4.88 U$1.1
N$7
  Top 0.152: C4.2 34.1,5.4 34.5,5 35.55,5 36.12,4.42 37.6,4.42 37.85,4.67 37.85,5.05 37.52,5.38 36.88,5.38 U$1.2
N$8
  Top 0.152: C2.1 35.08,6.47 35.58,6.47 36.17,5.88 U$1.3
N$9
  Top 0.152: C2.2 34.1,6.62 34.55,7.08 35.48,7.08 36.17,6.38 U$1.4
N$10
  Top 0.152: C5.1 35.15,9.7 35.27,9.7 35.88,10.3 35.88,10.57 36.17,10.88 U$1.13
N$11
  Top 0.152: 9-AXIS.21 33.08,2.12 33.08,1.27 32.8,1 32.8,0.9 C7.1
N$12
  Top 0.152: R5.1 38.05,14.07 38.05,10.88 37.55,10.38 36.88,10.38 U$1.12
N$13
  Top 0.152: C6.2 35.08,7.85 35.7,7.85 36.17,7.38 U$1.6
N$14
  Top 0.152: 9-AXIS.24 34.38,1.27 34.52,1.12 C20.1
N$15  (via drill 0.33)
  Top 0.152: v18.85,9.6 19.02,9.6 19.82,10.4 20.35,10.4 20.75,10 20.77,10 U1.20
  Bottom 0.152: v18.85,9.6 16.9,9.6 16.25,10.25 J1.D+
N$16  (via drill 0.33)
  Top 0.152: v37.98,1.8 R7.1
  Bottom 0.152: v37.98,1.8 37.98,3.7 38.65,4.38 38.65,5.53 U$3.1
N$17  (via drill 0.33)
  Top 0.152: v15.72,12.05 16.3,12.62 17.32,12.62 18.18,11.78 19.68,11.78 21.1,10.35 21.12,10.35 U1.19
  Bottom 0.152: v15.72,12.05 15.72,11.07 15.6,10.95 J1.D-
N$18  (via drill 0.33)
  Top 0.152: v18.8,5.33 19.68,5.33 20.07,5.72 U1.27 | v26.55,13.3 28.65,13.3 29.15,12.8 S3.1
  Bottom 0.152: v18.8,5.33 18.8,6.4 19.55,7.15 19.55,9.72 20.8,10.97 23.18,10.97 25.5,13.3 v26.55,13.3
N$19  (via drill 0.33)
  Top 0.152: v22.25,8.78 22.25,7.65 21.43,6.83 20.45,6.83 U1.26 | v21.65,12.7 20.25,12.7 20.1,12.85 S1.1
  Route15 0.152: v22.25,8.78 21.65,9.38 v21.65,12.7
N$20
  Top 0.152: S4.1 6.1,10.07 7.92,8.25 JP8.1
N$21  (via drill 0.33)
  Top 0.152: v42,2.45 R10.2
  Bottom 0.152: v42,2.45 42,10.25 39.02,13.22 38.65,13.22 U$3.8
PIO0_1  (1 unrouted)
SD_CD  (via drill 0.33)
  Top 0.152: v20.32,7.4 U1.25
  Route2 0.152: v22.27,9.62 20.32,7.67 v20.32,7.4
  Bottom 0.152: v22.27,9.62 23.68,11.03 27.52,11.03 U$3.9
SSP1_MISO  (via drill 0.33)
  Top 0.152: v23.12,7.38 20.8,5.05 U1.29
  Route2 0.152: v34.3,11.47 34.77,11.95 40.1,11.95 v40.1,11.32
  Route15 0.152: v23.12,8.7 v23.12,7.38
  Bottom 0.152: v23.12,8.7 24.25,8.7 25.8,10.25 28.57,10.25 29.8,11.47 v34.3,11.47 | v40.1,11.32 39.3,12.12 38.65,12.12 U$3.7
SSP1_MOSI  (via drill 0.33)
  Top 0.152: v23.12,9.65 21.85,10.93 21.85,11.03 U1.17
  Route15 0.152: v23.12,9.65 23.4,9.38 v25.75,9.38
  Bottom 0.152: v25.75,9.38 36.8,9.38 38.45,7.72 U$3.3
SSP1_SCK  (via drill 0.33)
  Top 0.152: v23.27,13.38 23.27,12.47 U1.13
  Bottom 0.152: v23.27,13.38 25.12,13.38 25.62,13.88 34.5,13.88 38.45,9.93 U$3.5
SSP1_SSEL  (via drill 0.33)
  Top 0.152: v26.82,2.45 26.23,2.45 25.77,2.9 25.75,2.9 U1.38
  Bottom 0.152: v26.82,2.45 29.35,2.45 29.82,2.92 32.15,2.92 35.85,6.62 U$3.2
USB_VBUS  (via drill 0.33)
  Top 0.152: v11.68,10.07 S4.3
  Bottom 0.152: v11.68,10.07 12.8,10.07 12.97,9.9 14.6,9.9 14.95,10.25 J1.VBUS
VBUS
  Top 0.152: C17.1 3.52,8.47 JP2.4 2.52,9.57 3.77,10.82 C18.1 | S4.2 7.5,11.68 6.65,12.53 JP5.1
  Bottom 0.152: U$2.3 8.38,9.3 7.75,9.93 7.75,10.57 8.38,11.2 U$2.1 8.12,11.05 6.65,12.53 JP5.1 | 9.55,3.3 9.8,3.3 JP6.1 | 9.55,3.3 U$6.3 | U$6.1 8.93,5.2 9.55,4.58 9.55,3.3
  pour Route2: 0.25,14.5 12.5,14.75 12.5,0.25 0.25,0
(copper drawn outside any net)
  shapes: Top area x2